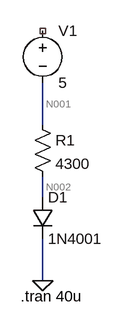
[diagram p0: schematic Draft2.asc]
Draft2.asc, the LTspice schematic file:
Version 4
SHEET 1 880 680
WIRE 176 16 176 -48
WIRE 176 128 176 96
WIRE 176 256 176 192
FLAG 176 256 0
SYMBOL diode 160 128 R0
SYMATTR InstName D1
SYMATTR Value 1N4001
SYMBOL res 160 0 R0
SYMATTR InstName R1
SYMATTR Value 4300
SYMBOL voltage 176 -144 R0
WINDOW 123 0 0 Left 0
WINDOW 39 0 0 Left 0
SYMATTR InstName V1
SYMATTR Value 5
TEXT 142 280 Left 2 !.tran 40u

The netlist it stands for:
* Draft2.asc
D1 N002 0 1N4001
R1 N001 N002 4300
V1 NC_01 N001 5
.model D D
.lib standard.dio
.tran 40u
.backanno
.end

* Results of the author's LTspice run, read from the files saved beside the schematic
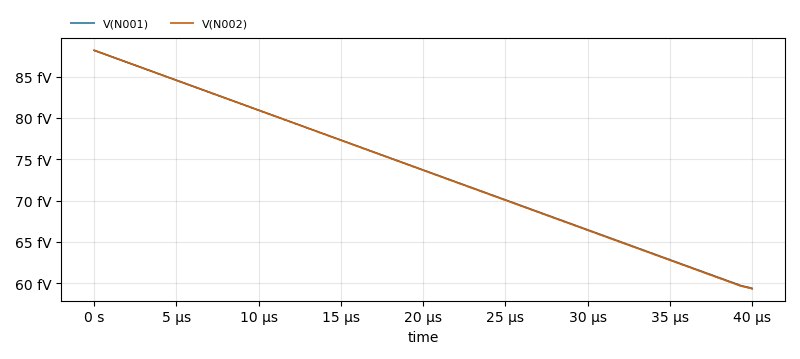
[diagram p1: Transient Analysis of Draft2.asc, plotted from the saved traces]
* Transient Analysis, 1 run:
*   V(N001): min 59.31 fV, max 88.18 fV, average 73.7 fV, rms 75.06 fV, last 59.31 fV
*   V(N002): min 59.35 fV, max 88.18 fV, average 73.67 fV, rms 75.04 fV, last 59.35 fV